# Altium project Adapter24.PrjPcb
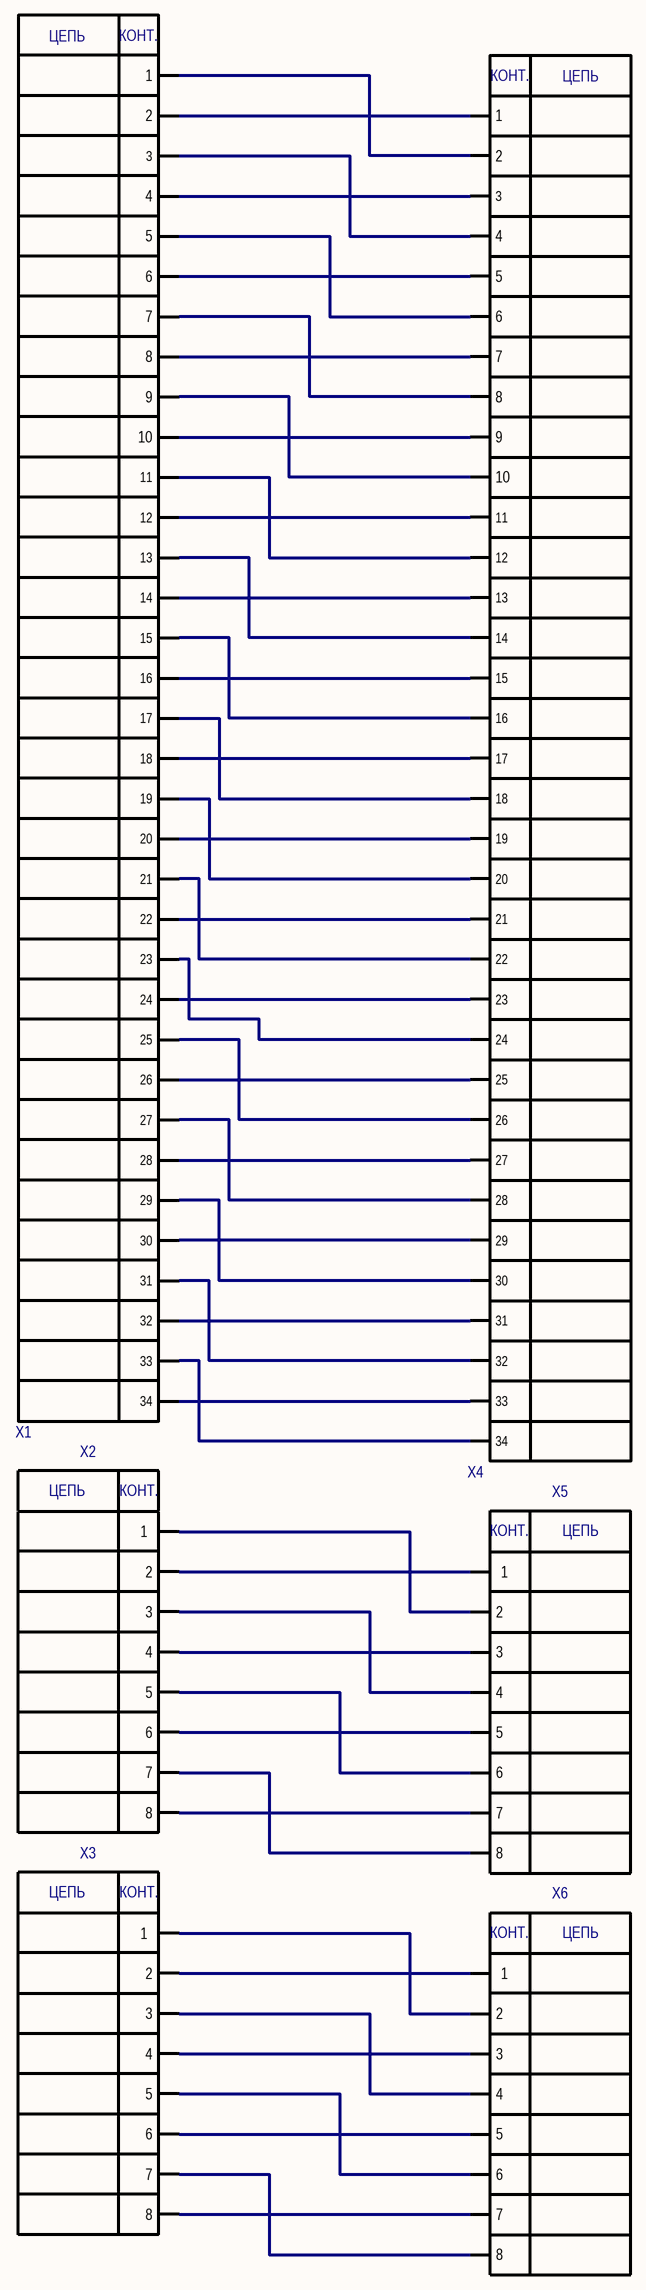
[diagram p0: Sheet1.SchDoc]
1 sheet, 6 parts. Net scope: global (net labels, ports and power ports of the same name join across sheets).
Board file: Adapter24.PcbDoc

## Sheet Sheet1.SchDoc
size 840 x 594 mm; SheetNumber: 1; SheetTotal: 1

### Parts
X1  PLD-34  [PLD-34]  (value not drawn)
X2  PLD-8  [PLD-8]  (value not drawn)
X3  PLD-8  [PLD-8]  (value not drawn)
X4  PLD-34  [PLD-34]  (value not drawn)
X5  PLD-8  [PLD-8]  (value not drawn)
X6  PLD-8  [PLD-8]  (value not drawn)

### Nets
NetX1_1: X1.1 X4.2
NetX1_2: X1.2 X4.1
NetX1_3: X1.3 X4.4
NetX1_4: X1.4 X4.3
NetX1_5: X1.5 X4.6
NetX1_6: X1.6 X4.5
NetX1_7: X1.7 X4.8
NetX1_8: X1.8 X4.7
NetX1_9: X1.9 X4.10
NetX1_10: X1.10 X4.9
NetX1_11: X1.11 X4.12
NetX1_12: X1.12 X4.11
NetX1_13: X1.13 X4.14
NetX1_14: X1.14 X4.13
NetX1_15: X1.15 X4.16
NetX1_16: X1.16 X4.15
NetX1_17: X1.17 X4.18
NetX1_18: X1.18 X4.17
NetX1_19: X1.19 X4.20
NetX1_20: X1.20 X4.19
NetX1_21: X1.21 X4.22
NetX1_22: X1.22 X4.21
NetX1_23: X1.23 X4.24
NetX1_24: X1.24 X4.23
NetX1_25: X1.25 X4.26
NetX1_26: X1.26 X4.25
NetX1_27: X1.27 X4.28
NetX1_28: X1.28 X4.27
NetX1_29: X1.29 X4.30
NetX1_30: X1.30 X4.29
NetX1_31: X1.31 X4.32
NetX1_32: X1.32 X4.31
NetX1_33: X1.33 X4.34
NetX1_34: X1.34 X4.33
NetX2_1: X2.1 X5.2
NetX2_2: X2.2 X5.1
NetX2_3: X2.3 X5.4
NetX2_4: X2.4 X5.3
NetX2_5: X2.5 X5.6
NetX2_6: X2.6 X5.5
NetX2_7: X2.7 X5.8
NetX2_8: X2.8 X5.7
NetX3_1: X3.1 X6.2
NetX3_2: X3.2 X6.1
NetX3_3: X3.3 X6.4
NetX3_4: X3.4 X6.3
NetX3_5: X3.5 X6.6
NetX3_6: X3.6 X6.5
NetX3_7: X3.7 X6.8
NetX3_8: X3.8 X6.7

### Notes on the sheet
- 578 ВП МО РФ
- Зам. гл. к. ОКР по констр.
- Перв. примен.
- ОНиЭКБ
- Справ. №
- Подп. и дата
- ЛНС
- Инв. № дубл.
- Взам. инв. №
- Изм.
- Лист
- № докум.
- Подп.
- Дата
- Лит.
- Масса
- Масштаб
- Т.контр.
- Пров.
- Разраб.
- Листов
- Нач. КС
- Инв. № подл.
- Н.контр.
- Утв.
- Копировал
- Формат А1
- (in symbol PLD-8) ЦЕПЬ; КОНТ.
- (in symbol PLD-34) ЦЕПЬ; КОНТ.

### Library data of the parts
X1 X4 = PLD-34: Штыри на плату, шаг 2,54мм, двухрядные; Manufacturer: *; ManufacturerPartNumber: PLD-34; Type: Вилка
X2 X3 X5 X6 = PLD-8: Штыри на плату шаг 2.54мм., двухрядные; Manufacturer: Бурый Медведь; SymAuthor: Календарова В.; BCPId: *; ManufacturerPartNumber: PLD-8; Type: Розетка